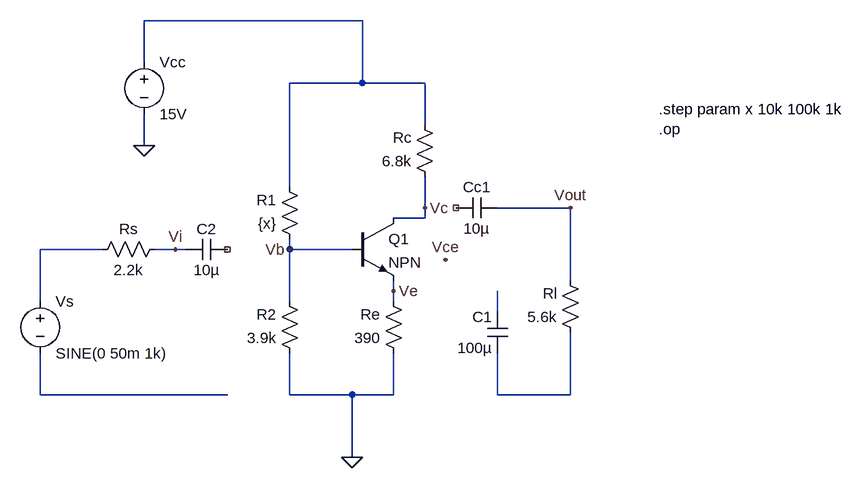
[diagram p0: schematic Lab1_Vce.asc]
Lab1_Vce.asc, the LTspice schematic file:
Version 4
SHEET 1 1296 680
WIRE 464 -288 128 -288
WIRE 128 -224 128 -288
WIRE 464 -192 464 -288
WIRE 464 -192 352 -192
WIRE 560 -192 464 -192
WIRE 560 -128 560 -192
WIRE 128 -96 128 -144
WIRE 352 -32 352 -192
WIRE 560 0 560 -48
WIRE 784 0 672 0
WIRE 560 16 560 0
WIRE 560 16 512 16
WIRE 64 64 -32 64
WIRE 176 64 144 64
WIRE 192 64 176 64
WIRE 352 64 352 48
WIRE 448 64 352 64
WIRE 784 112 784 0
WIRE 512 128 512 112
WIRE -32 144 -32 64
WIRE 352 144 352 64
WIRE 512 144 512 128
WIRE 672 160 672 128
WIRE -32 288 -32 224
WIRE 256 288 -32 288
WIRE 352 288 352 224
WIRE 448 288 352 288
WIRE 512 288 512 224
WIRE 512 288 448 288
WIRE 672 288 672 224
WIRE 784 288 784 192
WIRE 784 288 672 288
WIRE 448 384 448 288
FLAG 128 -96 0
FLAG 448 384 0
FLAG 352 64 Vb
FLAG 176 64 Vi
FLAG 512 128 Ve
FLAG 592 80 Vce
FLAG 560 0 Vc
FLAG 784 0 Vout
SYMBOL voltage -32 128 R0
WINDOW 123 0 0 Left 0
WINDOW 39 0 0 Left 0
SYMATTR InstName Vs
SYMATTR Value SINE(0 50m 1k)
SYMBOL res 160 48 R90
WINDOW 0 0 56 VBottom 2
WINDOW 3 32 56 VTop 2
SYMATTR InstName Rs
SYMATTR Value 2.2k
SYMBOL res 368 64 R180
WINDOW 0 36 76 Left 2
WINDOW 3 36 40 Left 2
SYMATTR InstName R1
SYMATTR Value {x}
SYMBOL res 576 -32 R180
WINDOW 0 36 76 Left 2
WINDOW 3 36 40 Left 2
SYMATTR InstName Rc
SYMATTR Value 6.8k
SYMBOL cap 256 48 R90
WINDOW 0 0 32 VBottom 2
WINDOW 3 32 32 VTop 2
SYMATTR InstName C2
SYMATTR Value 10µ
SYMBOL cap 672 -16 R90
WINDOW 0 0 32 VBottom 2
WINDOW 3 32 32 VTop 2
SYMATTR InstName Cc1
SYMATTR Value 10µ
SYMBOL cap 688 224 R180
WINDOW 0 24 56 Left 2
WINDOW 3 24 8 Left 2
SYMATTR InstName C1
SYMATTR Value 100µ
SYMBOL res 368 240 R180
WINDOW 0 36 76 Left 2
WINDOW 3 36 40 Left 2
SYMATTR InstName R2
SYMATTR Value 3.9k
SYMBOL voltage 128 -240 R0
WINDOW 123 0 0 Left 0
WINDOW 39 0 0 Left 0
SYMATTR InstName Vcc
SYMATTR Value 15V
SYMBOL npn 448 16 R0
SYMATTR InstName Q1
SYMBOL res 528 240 R180
WINDOW 0 36 76 Left 2
WINDOW 3 36 40 Left 2
SYMATTR InstName Re
SYMATTR Value 390
SYMBOL res 800 208 R180
WINDOW 0 36 76 Left 2
WINDOW 3 36 40 Left 2
SYMATTR InstName Rl
SYMATTR Value 5.6k
TEXT 920 -152 Left 2 !.step param x 10k 100k 1k\n.op

The netlist it stands for:
* Lab1_Vce.asc
Vs N002 N004 SINE(0 50m 1k)
Rs Vi N002 2.2k
R1 Vb N001 {x}
Rc Vc N001 6.8k
C2 NC_01 Vi 10µ
Cc1 Vout NC_02 10µ
C1 N005 N003 100µ
R2 0 Vb 3.9k
Vcc N001 0 15V
Q1 Vc Vb Ve 0 NPN
Re 0 Ve 390
Rl N005 Vout 5.6k
.model NPN NPN
.model PNP PNP
.lib standard.bjt
.step param x 10k 100k 1k
.op
.backanno
.end